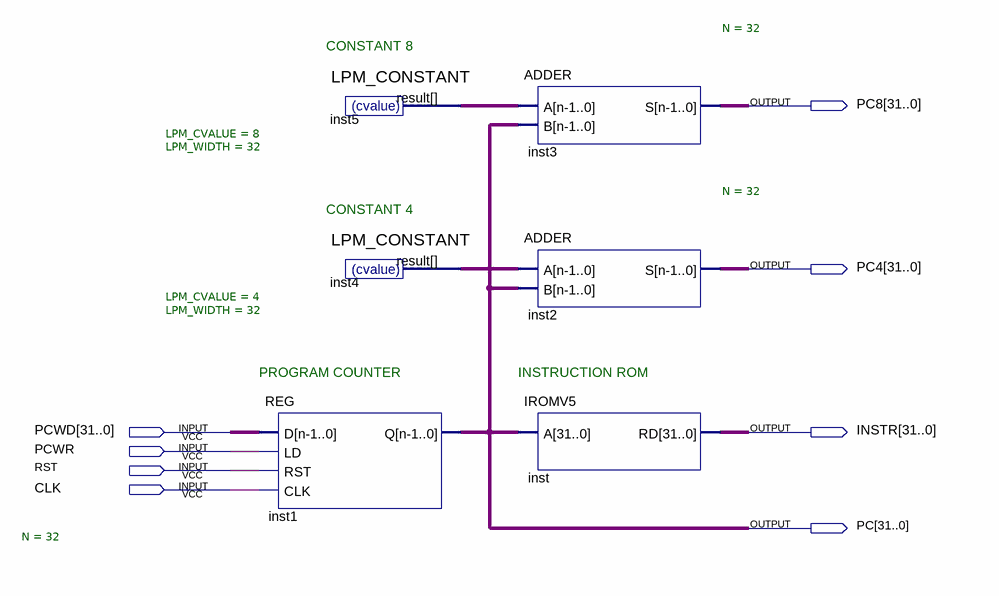
[diagram p0: schematic sheet]
// Quartus schematic FETCH.bdf as structural Verilog: 6 symbols, 8 pins
module FETCH (
  input  [31:0] PCWD,
  input  PCWR,
  input  RST,
  input  CLK,
  output [31:0] PC8,
  output [31:0] PC4,
  output [31:0] INSTR,
  output [31:0] PC
);

  wire [31:0] inst4_result, inst5_result;

  REG #(.N(32)) inst1 (.D(PCWD), .LD(PCWR), .RST(RST), .CLK(CLK), .Q(PC));
  LPM_CONSTANT #(.LPM_CVALUE(8), .LPM_WIDTH(32)) inst5 (.result(inst5_result));
  LPM_CONSTANT #(.LPM_CVALUE(4), .LPM_WIDTH(32)) inst4 (.result(inst4_result));
  ADDER #(.N(32)) inst3 (.A(inst5_result), .B(PC), .S(PC8));
  ADDER #(.N(32)) inst2 (.A(inst4_result), .B(PC), .S(PC4));
  IROMV5 inst (.A(PC), .RD(INSTR));

  // Notes on the sheet:
  //   CONSTANT 8
  //   CONSTANT 4
  //   PROGRAM COUNTER
  //   INSTRUCTION ROM
endmodule
